# EAGLE design magBoard (EAGLE 6.4)
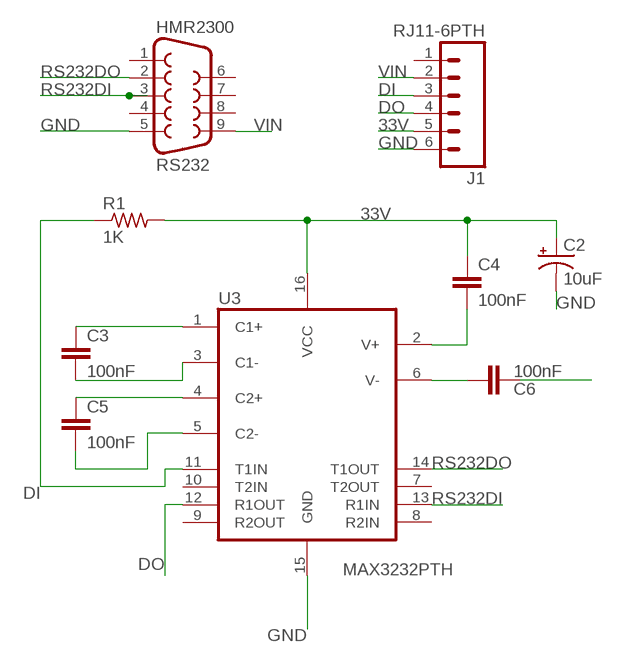
[diagram p0: schematic, sheet 1]

## Parts
C2  10uF  CAP_POLPTH2  [CPOL-RADIAL-10UF-25V]
C3  100nF  CAPKIT  [CAP-PTH-SMALL-KIT]
C4  100nF  CAPKIT  [CAP-PTH-SMALL-KIT]
C5  100nF  CAPKIT  [CAP-PTH-SMALL-KIT]
C6  100nF  CAPKIT  [CAP-PTH-SMALL-KIT]
HMR2300  RS232  DB9FEMALE  [DB9]
J1  RJ11-6PTH  [RJ11-6]
R1  1K  R-US_0204/5  [0204/5]
U3  MAX3232PTH  MAX232PTH  [DIL16]

## Nets
33V: C2.1(+) C4.1 J1.5 R1.2 U3.16(VCC)
DI: J1.3 R1.1 U3.11(T1IN)
DO: J1.4 U3.12(R1OUT)
GND: C2.2(-) C6.2 HMR2300.5 J1.6 U3.15(GND)
N$2: C3.1 U3.1(C1+)
N$3: C3.2 U3.3(C1-)
N$4: C5.1 U3.4(C2+)
N$5: C5.2 U3.5(C2-)
N$8: C4.2 U3.2(V+)
N$12: C6.1 U3.6(V-)
RS232DI: HMR2300.3 U3.13(R1IN)
RS232DO: HMR2300.2 U3.14(T1OUT)
VIN: HMR2300.9 J1.2
Unconnected: HMR2300.1 HMR2300.4 HMR2300.6 HMR2300.7 HMR2300.8 J1.1 U3.7(T2OUT) U3.8(R2IN) U3.9(R2OUT) U3.10(T2IN)

## Library data of the parts
C2 = SparkFun-Capacitors:CAP_POL: Capacitor Polarized These are standard SMD and PTH capacitors. Normally 10uF, 47uF, and 100uF in electrolytic and tantalum varieties. Always verify the external diameter of the through hole cap, it varies with capacity, voltage, and manufacturer. The EIA devices should be standard.
C3-C6 = SparkFun-Capacitors:CAP: Capacitor Standard 0603 ceramic capacitor, and 0.1" leaded capacitor.
HMR2300 = SparkFun-Connectors:DB9: DB9 Connector Standard DB9 (D-Sub 9) serial connector. Can be used for CAN bus as well as RS485 and RS232. Footprint production proven. Spark Fun Electronics SKU : PRT-00429
J1 = SparkFun-Connectors:RJ11-6: RJ11 Jack Simple 6 pin RJ11 jack. Commonly found on CAT3 devices and Microchip programmers. SKU: PRT-00132
R1 = rcl:R-US_: RESISTOR, American symbol
U3 = SparkFun-DigitalIC:MAX232: RS232 Transceiver Very common IC. This is generically called 'MAX232', but works with the 3V equivalent MAX3232 generic ICs. Field tested and mother approved. Spark Fun Electronics SKU : COM-00316 (DIP) and COM-00589 (SMD)

## Board
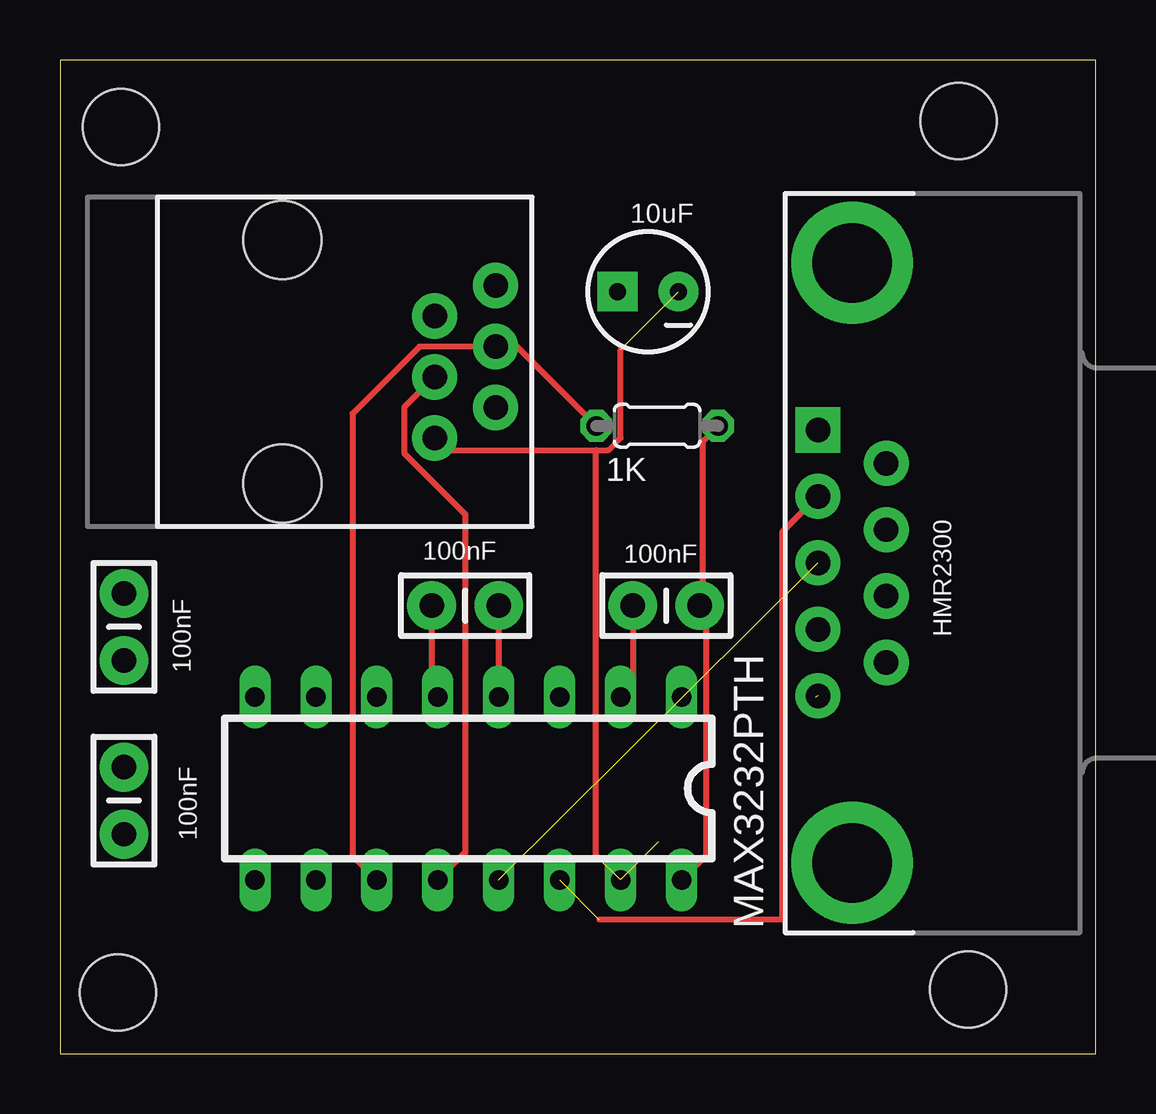
[diagram p1: board, top side]
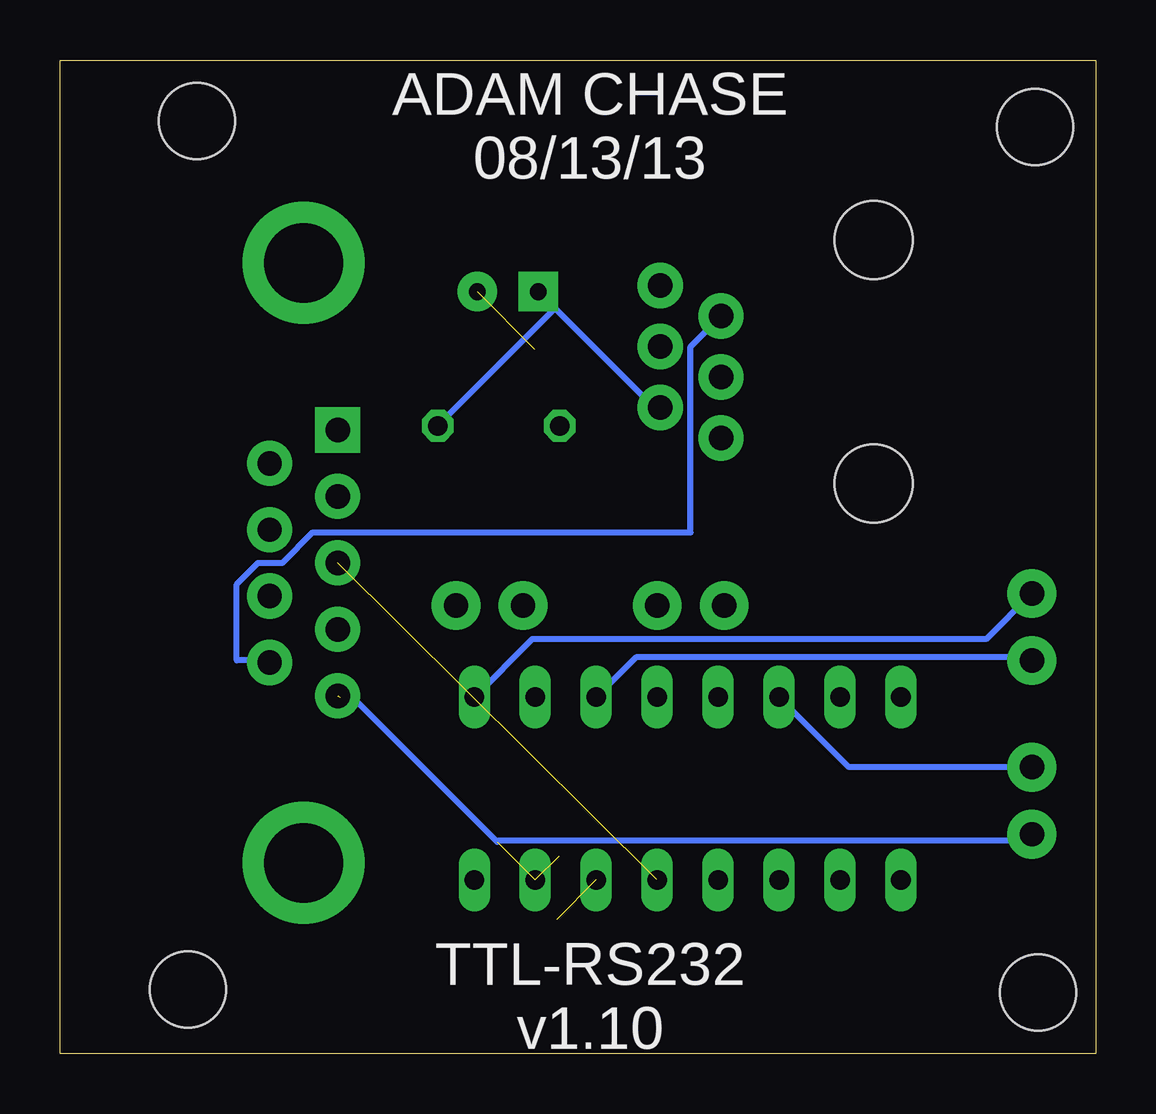
[diagram p2: board, bottom side, seen from below]

Size 43.18 x 41.4 mm. Coordinates in mm from the lower left corner, seen from the top.
Outline: 0,0 43.18,0 43.18,41.4 0,41.39 0,0
Copper layers (1*16): Top 0.035mm / dielectric 1.5mm / Bottom 0.035mm
Design rules "default": minimum track width 10mil, minimum drill 24mil, track to track 8mil, track to pad 8mil, pad to pad 8mil, via to via 8mil, smd to smd 8mil, copper to edge 40mil, drill to drill 8mil, minimum pad ring 10mil, minimum via ring 8mil, stop-mask expansion 4mil, vias tented up to drill 0mil, thermal gap 10mil
Holes 3.17 mm at 2.54,38.61 2.41,2.54 37.85,2.67 37.47,38.86

### Footprints (pad centres in the part's own frame; a part is rotated, then mirrored left to right if it is on the bottom)
CPOL-RADIAL-10UF-25V = drill 0.7 pad 1.651 square: 1 1.27,0 | drill 0.7 pad 1.651: 2 -1.27,0
CAP-PTH-SMALL-KIT = drill 1.016 pad 2.032: 1 -1.397,0; 2 1.397,0
DB9 = drill 1.016 pad 1.88 square: 1 -5.54,-1.42 | drill 1.016 pad 1.88: 2 -2.77,-1.42; 3 0,-1.42; 4 2.77,-1.42; 5 5.54,-1.42; 6 -4.15,1.42; 7 -1.38,1.42; 8 1.38,1.42; 9 4.15,1.42 | drill 3.302 pad 5.08: G1 -12.5,0; G2 12.5,0
RJ11-6 = drill 1.016 pad 1.88: 1 1.905,8.89; 2 3.175,6.35; 3 4.445,8.89; 4 5.715,6.35; 5 6.985,8.89; 6 8.255,6.35 | hole 3.251: 0,0; 10.16,0
0204/5 = drill 0.813 octagon: 1 -2.54,0; 2 2.54,0
DIL16 = drill 0.813 long: 1 -8.89,-3.81; 2 -6.35,-3.81; 3 -3.81,-3.81; 4 -1.27,-3.81; 5 1.27,-3.81; 6 3.81,-3.81; 7 6.35,-3.81; 8 8.89,-3.81; 9 8.89,3.81; 10 6.35,3.81; 11 3.81,3.81; 12 1.27,3.81; 13 -1.27,3.81; 14 -3.81,3.81; 15 -6.35,3.81; 16 -8.89,3.81

### Placement (x,y rotation side)
C2  24.51,31.75 180 top
C3  2.67,17.78 270 top
C4  25.27,18.67 180 top
C5  16.89,18.67 180 top
C6  2.67,10.54 270 top
HMR2300  33.02,20.45 270 top
J1  9.27,33.91 270 top
R1  24.89,26.16 0 top
U3  17.02,11.05 180 top

### Tracks (layer width: path | path; a pad name or v marks a point on that pad's centre or on a via)
33V
  Top 0.254: U3.16 26.92,8.26 26.92,18.41 C4.1 26.8,18.67 26.8,25.53 R1.2
  Bottom 0.254: J1.5 18.41,26.92 C2.1 22.61,30.99 R1.2
DI
  Top 0.254: U3.11 12.19,8.26 12.19,26.67 14.99,29.46 J1.3 19.05,29.46 R1.1
DO
  Top 0.254: U3.12 16.89,8.38 16.89,22.48 14.35,25.02 14.35,26.92 J1.4
GND  (4 unrouted)
  Top 0.254: 23.37,29.34 23.37,25.65 22.86,25.15 22.35,25.15 | 22.35,25.15 15.62,25.15 J1.6 | 22.35,8.26 22.35,25.15
  Bottom 0.254: 31.5,14.86 30.99,14.86 24.96,8.83 24.89,8.89 2.92,8.89 C6.2
N$2
  Bottom 0.254: U3.1 23.5,17.27 4.57,17.27 C3.1
N$3
  Bottom 0.254: U3.3 19.18,16.51 2.79,16.51 C3.2
N$4
  Top 0.254: C5.1 U3.4
N$5
  Top 0.254: U3.5 15.49,15.11 C5.2
N$8
  Top 0.254: U3.2 23.88,15.37 C4.2
N$12
  Bottom 0.254: U3.6 10.29,11.94 C6.1
RS232DI  (1 unrouted)
RS232DO  (1 unrouted)
  Top 0.254: 22.48,5.59 30.1,5.59 30.1,21.72 31.5,23.11 HMR2300.2
VIN
  Bottom 0.254: J1.2 16.89,29.46 16.89,21.72 32.64,21.72 33.91,20.45 34.92,20.45 35.81,19.56 35.81,16.38 34.54,16.38 HMR2300.9

### Text on the board
tPlace: 100nF | 100nF | 100nF | 100nF
bPlace: ADAM CHASE / 08/13/13 | TTL-RS232 / v1.10